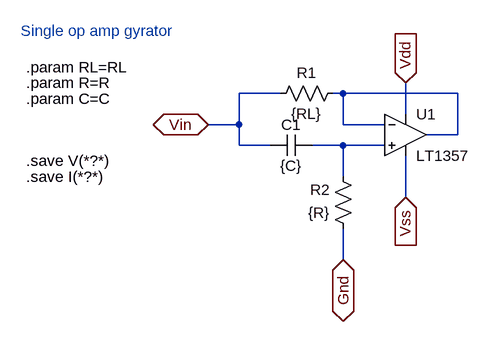
[diagram p0: schematic Gyr1.asc]
Gyr1.asc, the LTspice schematic file:
Version 4
SHEET 1 880 680
WIRE 160 112 96 112
WIRE 256 112 240 112
WIRE 432 112 256 112
WIRE 352 144 352 96
WIRE 96 160 96 112
WIRE 96 160 48 160
WIRE 256 160 256 112
WIRE 320 160 256 160
WIRE 432 176 432 112
WIRE 432 176 384 176
WIRE 96 192 96 160
WIRE 144 192 96 192
WIRE 256 192 208 192
WIRE 320 192 256 192
WIRE 256 240 256 192
WIRE 352 272 352 208
WIRE 256 368 256 320
FLAG 352 96 Vdd
IOPIN 352 96 In
FLAG 352 272 Vss
IOPIN 352 272 In
FLAG 256 368 Gnd
IOPIN 256 368 BiDir
FLAG 48 160 Vin
IOPIN 48 160 BiDir
SYMBOL OpAmps\\LT1357 352 112 R0
SYMATTR InstName U1
SYMBOL res 256 96 R90
WINDOW 0 0 56 VBottom 2
WINDOW 3 32 56 VTop 2
SYMATTR InstName R1
SYMATTR Value {RL}
SYMBOL res 272 336 R180
WINDOW 0 36 76 Left 2
WINDOW 3 36 40 Left 2
SYMATTR InstName R2
SYMATTR Value {R}
SYMBOL cap 208 176 R90
WINDOW 0 0 32 VBottom 2
WINDOW 3 32 32 VTop 2
SYMATTR InstName C1
SYMATTR Value {C}
TEXT -240 16 Left 2 ;Single op amp gyrator
TEXT -232 72 Left 2 !.param RL=RL
TEXT -232 216 Left 2 !.save V(*?*)
TEXT -232 96 Left 2 !.param R=R
TEXT -232 120 Left 2 !.param C=C
TEXT -232 240 Left 2 !.save I(*?*)

The netlist it stands for:
* Gyr1.asc
XU1 N002 N001 Vdd Vss N001 LT1357  ; pins In+ In- V+ V- OUT
R1 N001 Vin {RL}
R2 Gnd N002 {R}
C1 N002 Vin {C}
* Single op amp gyrator
.param RL=RL
.save V(*?*)
.param R=R
.param C=C
.save I(*?*)
.backanno
.end